# EAGLE design bluetooth_adapter (EAGLE 9.6.1)
ABTEILUNG: Technische Informatik; BEARBEITER: Markus Zundl; DATUM: 04.05.2020; DOKUMENTART: Schaltplan; GEZ: ZunM; ID: 4AHEL; REV: R1; SCHALTPLAN: Bluetooth Adapter; SCHALTPLAN2: Trinity; STATUS: Prototyp; VER: 1.0
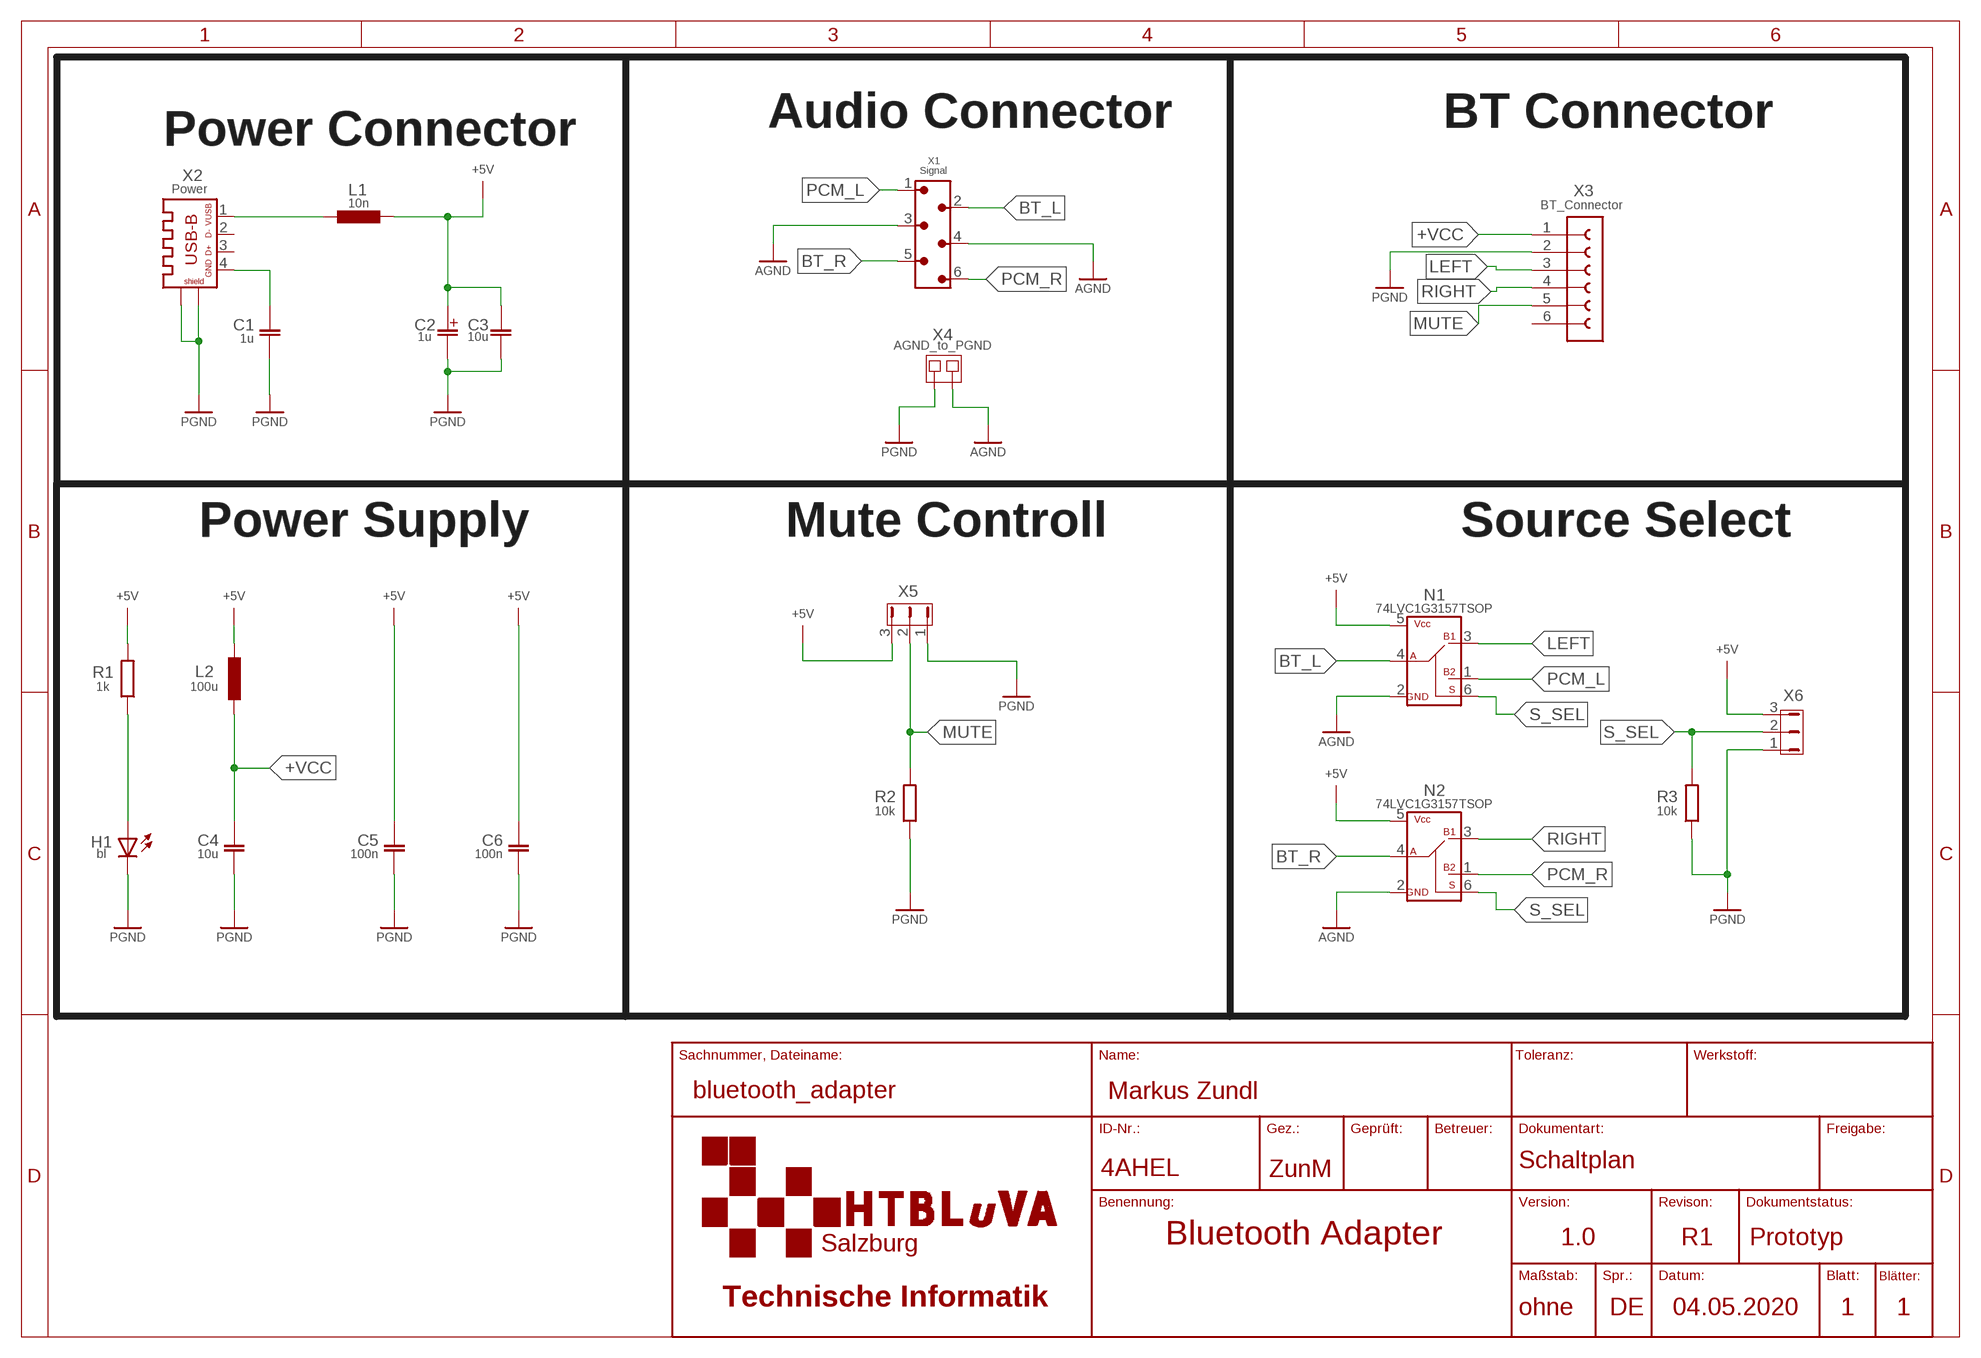
[diagram p0: schematic, sheet 1]

## Parts
C1  1u  C-EUC3216  [C3216]
C2  1u  CPOL-EUA/3216-18R  [A/3216-18R]
C3  10u  C-EUC3216  [C3216]
C4  10u  C-EUC3216  [C3216]
C5  100n  C-EUC3216  [C3216]
C6  100n  C-EUC3216  [C3216]
H1  bl  LEDCHIPLED_0805  [CHIPLED_0805]
L1  10n  L-EUL1210  [L1210]
L2  100u  L-EUL0805  [L0805]
N1  74LVC1G3157TSOP  [TSOP6]
N2  74LVC1G3157TSOP  [TSOP6]
R1  1k  R-EU_R0805  [R0805]
R2  10k  R-EU_R0805  [R0805]
R3  10k  R-EU_R0805  [R0805]
X1  Signal  WUERT_BUCHSE_6POL  [690357100672]
X2  Power  USB-B_432411  [MYLIB_USB-B-LUM]
X3  BT_Connector  CONNECTORS_FEMHD-1X61X6_BDIA  [MYCONNECTORS_FE-1X6_BDIA]
X4  AGND_to_PGND  JUMPSMD1FACH-1  [MYLIB_SJ]
X5  JP2E  [MYLIB_JP2]
X6  JP2E  [MYLIB_JP2]

## Nets
+5V: C2.+ C3.1 C5.1 C6.1 L1.2 L2.2 N1.5(VCC) N2.5(VCC) R1.2 X5.3 X6.3
+VCC: C4.1 L2.1 X3.1
AGND: N1.2(GND) N2.2(GND) X1.3 X1.4 X4.2
BT_L: N1.4(A) X1.2
BT_R: N2.4(A) X1.5
LEFT: N1.3(B1) X3.3
MUTE: R2.2 X3.5 X5.2
N$1: H1.A R1.1
N$2: C1.1 X2.4
N$3: L1.1 X2.1
PCM_L: N1.1(B2) X1.1
PCM_R: N2.1(B2) X1.6
PGND: C1.2 C2.- C3.2 C4.2 C5.2 C6.2 H1.C R2.1 R3.1 X2.SH@1(SH1) X2.SH@2(SH2) X3.2 X4.1 X5.1 X6.1
RIGHT: N2.3(B1) X3.4
S_SEL: N1.6(S) N2.6(S) R3.2 X6.2
Unconnected: X2.2 X2.3 X3.6

## Notes on the sheet
- Audio Connector | BT Connector
- Power Connector
- Power Supply | Mute Controll | Source Select

## Library data of the parts
C1 C3-C6 = rcl_HTL_V1:C-EU: CAPACITOR, European symbol
C2 = rcl_HTL_V1:CPOL-EU: POLARIZED CAPACITOR, European symbol
H1 = led_HTL_V1:LED: LED, EN-60617 OSRAM: - CHIPLED LG R971, LG N971, LY N971, LG Q971, LY Q971, LO R971, LY R971 LH N974, LH R974 LS Q976, LO Q976, LY Q976 LO Q996 - Hyper CHIPLED LW Q18S LB Q993, LB Q99A, LB R99A - SideLED LS A670, LO A670, LY A670, LG A670, LP A670 LB A673, LV A673, LT A673, LW A673 LH A674 LY A675 LS A676, LA A676, LO A676, LY A676, LW A676 LS A679, LY A679, LG A679 - Hyper Micro SIDELED® LS Y876, LA Y876, LO Y876, LY Y876 LT Y87S - SmartLED LW L88C, LW L88S LB L89C, LB L89S, LG L890 LS L89K, LO L89K, LY L89K LS L896, LA L896, LO L896, LY L896 - TOPLED LS T670, LO T670, LY T670, LG T670, LP T670 LSG T670, LSP T670, LSY T670, LOP T670, LYG T670 LG T671, LOG T671, LSG T671 LB T673, LV T673, LT T673, LW T673 LH T674 LS T676, LA T676, LO T676, LY T676, LB T676, LH T676, LSB T676, LW T676 LB T67C, LV T67C, LT T67C, LS T67K, LO T67K, LY T67K, LW E67C LS E67B, LA E67B, LO E67B, LY E67B, LB E67C, LV E67C, LT E67C LW T67C LS T679, LY T679, LG T679 LS T770, LO T770, LY T770, LG T770, LP T770 LB T773, LV T773, LT T773, LW T773 LH T774 LS E675, LA E675, LY E675, LS T675 LS T776, LA T776, LO T776, LY T776, LB T776 LHGB T686 LT T68C, LB T68C - Hyper Mini TOPLED® LB M676 - Mini TOPLED Santana® LG M470 LS M47K, LO M47K, LY M47K Source: http://www.osram.convergy.de LUXEON: - LUMILED® LXK2-PW12-R00, LXK2-PW12-S00, LXK2-PW14-U00, LXK2-PW14-V00 LXK2-PM12-R00, LXK2-PM12-S00, LXK2-PM14-U00 LXK2-PE12-Q00, LXK2-PE12-R00, LXK2-PE12-S00, LXK2-PE14-T00, LXK2-PE14-U00 LXK2-PB12-K00, LXK2-PB12-L00, LXK2-PB12-M00, LXK2-PB14-N00, LXK2-PB14-P00, LXK2-PB14-Q00 LXK2-PR12-L00, LXK2-PR12-M00, LXK2-PR14-Q00, LXK2-PR14-R00 LXK2-PD12-Q00, LXK2-PD12-R00, LXK2-PD12-S00 LXK2-PH12-R00, LXK2-PH12-S00 LXK2-PL12-P00, LXK2-PL12-Q00, LXK2-PL12-R00 Source: www.luxeon.com KINGBRIGHT: KA-3528ASYC Source: www.kingbright.com
L1 = rcl_HTL_V1:L-EU: INDUCTOR, European symbol
L2 = rcl_HTL_V1:L-EUL: INDUCTOR, European symbol
N1 N2 = ic_HTL:74LVC1G3157
R1-R3 = rcl_HTL_V1:R-EU_: RESISTOR, European symbol
X1 = con_HTL:WUERT_BUCHSE_6POL: WR-MM Male Connector w/o Latch & w. Polarization KIND PROPERTIES: Pitch 2.54 mm Quality Class :25 Mating cycles Gender:Male MATERIAL PROPERTIES: Insulator Material:PBT Insulator Flammability Rating UL94 V-0 Insulator Color:Red Contact Material :Phosphor Bronze Contact Plating :Mat Tin over Nickel Contact Type: Stamped GENERAL PROPERTIES: Operating Temperature:-40 °C up to +105 °C Compliance Lead free / RoHS ELECTRICAL PROPERTIES: IR 1:1.5 A Working Voltage 100 V (AC) Withstanding Voltage:500 V (AC) Contact Resistance: 10 mΩ Insulation Resistance:1000 MΩ PACKAGING PROPERTIES: cULus Approval:E323964 Packaging :Tube <https://katalog.we-online.com/media/images/v2/o33157v209%20Family_WR-MM_69035710xx72.jpg> Details see: https://katalog.we-online.com/en/em/MM_1_27_MALE_CONNECTOR_W_O_LATCH_AND_WITH_POLARIZATION_69035710XX72 Updated by Yingchun,Shan 2019-10-28 2019 (C) Würth Elektronik; DATASHEET-URL: https://katalog.we-online.com/em/datasheet/690357100672.pdf; GENDER: Male; IR1: 1.5A; MATES: WR-MM Female Angled Connector w. Polarization and w/o Latch/Female Angled Connector w/o Latch & w/o Polarization/Female Angled Connector with Latch & w. Polarization/Female Connector w/o Latch & w/o Polarization/Female Connector with Latch & w/o Polarization/Female SMT Connector with Latch & Polarization/Female SMT Connector with Polarization; PACKAGING: Tube; PART-NUMBER: 690357100672; PINS: 6; TCP: per Row; TYPE: Straight
X2 = con_HTL:USB-B_43
X3 = con_HTL:CONNECTORS_FEMHD-1X6: Buchsenleiste wie SPF20 nur mit 6 Pins 1-reihig
X4 = con_HTL:JUMPSMD1FACH-1: SMD solder JUMPER
X5 X6 = con_HTL:JP2E: JUMPER

## Board
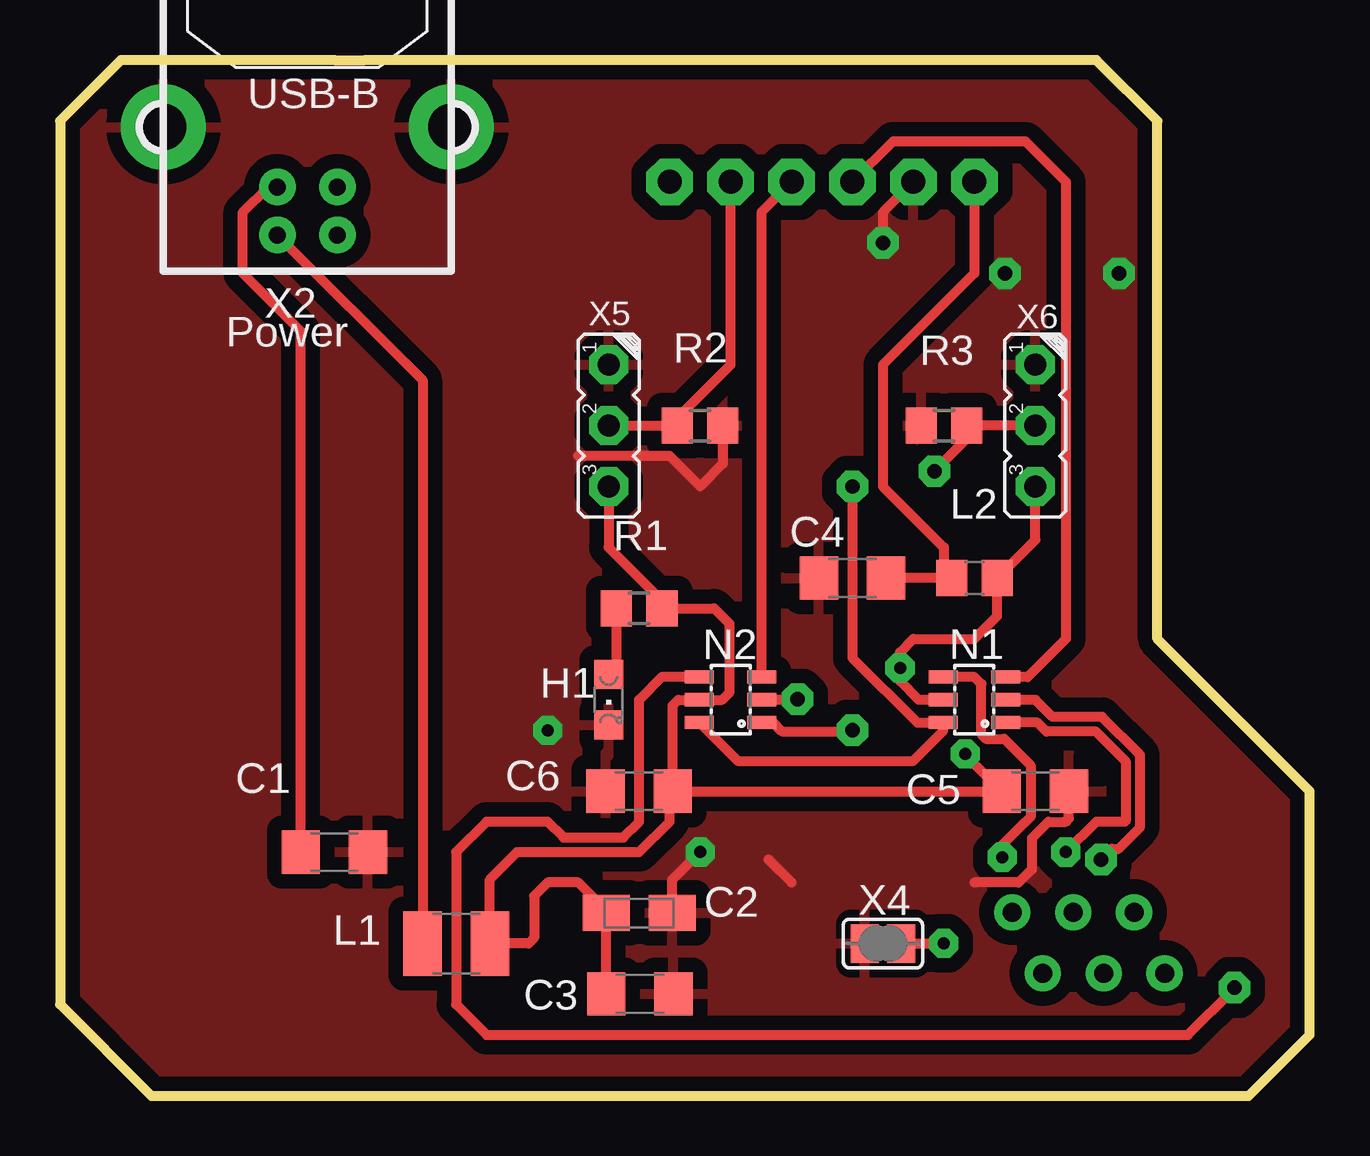
[diagram p1: board, top side]
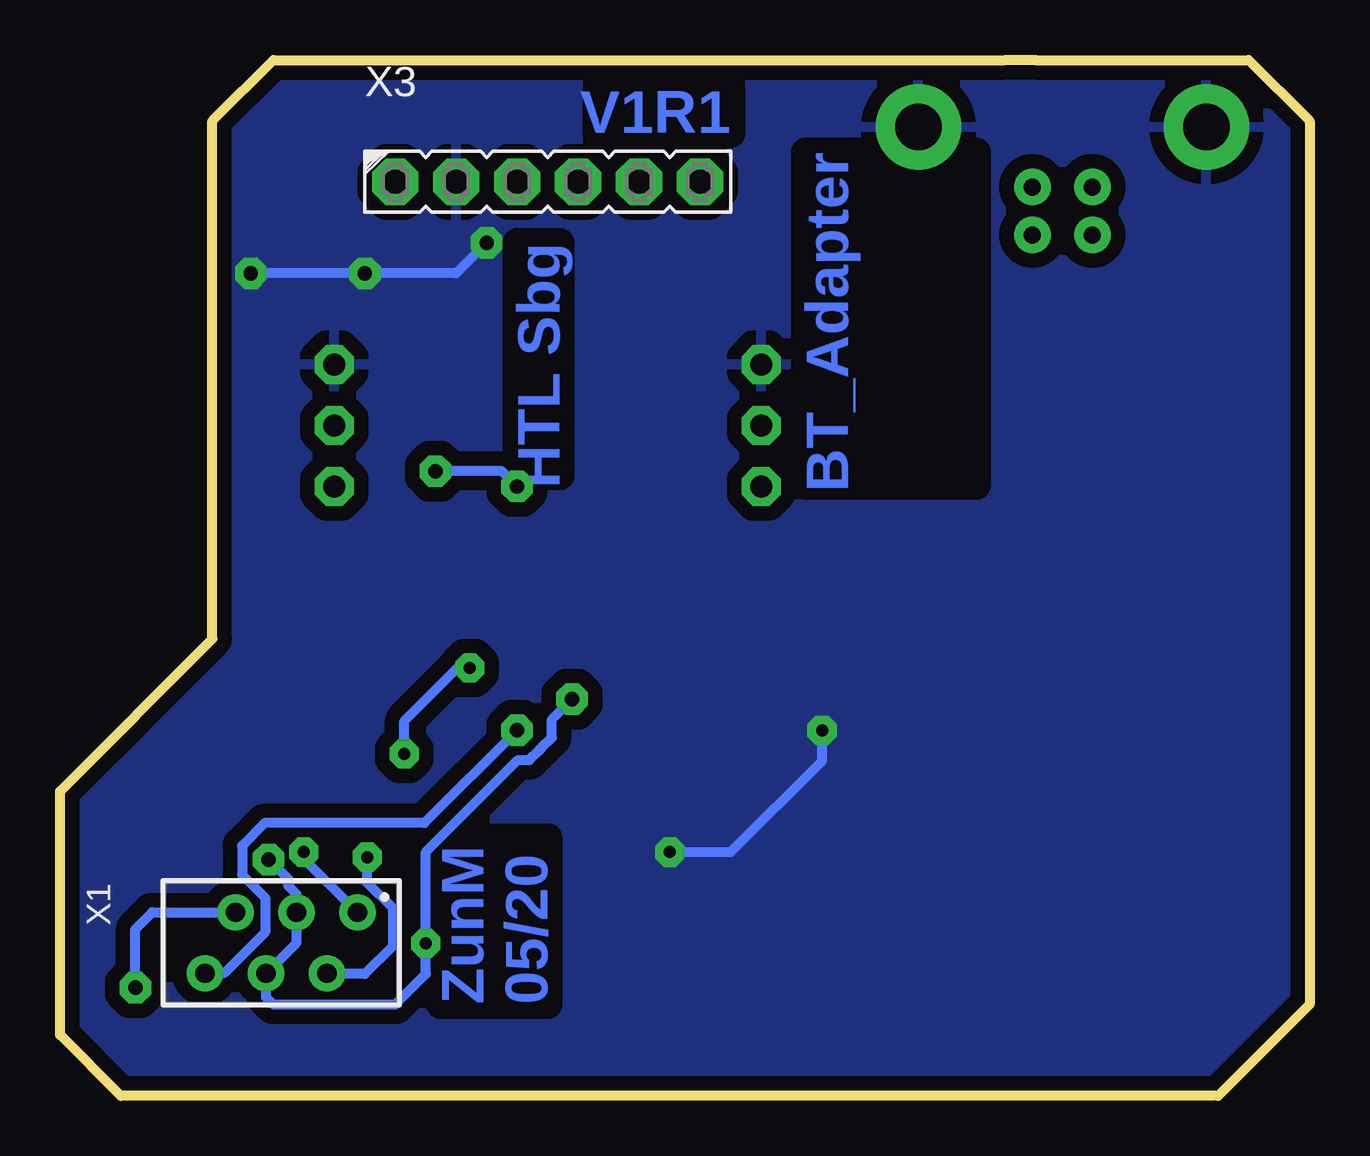
[diagram p2: board, bottom side, seen from below]

Size 52.07 x 43.18 mm. Coordinates in mm from the lower left corner, seen from the top.
Outline: 49.53,0 52.07,2.54 52.07,12.7 45.72,19.05 45.72,40.64 43.18,43.18 12.7,43.18 11.43,43.18 2.54,43.18 0,40.64 0,3.81 3.81,0 49.53,0
Copper layers (1+16): Top 0.035mm / dielectric 1.5mm / Bottom 0.035mm
Design rules "HTL": minimum track width 10mil, minimum drill 0.5mm, track to track 8mil, track to pad 8mil, pad to pad 8mil, via to via 8mil, smd to smd 8mil, copper to edge 10mil, drill to drill 8mil, minimum pad ring 14mil, minimum via ring 14mil, stop-mask expansion 4mil, vias tented up to drill 20mil, thermal gap 24mil

### Footprints (pad centres in the part's own frame; a part is rotated, then mirrored left to right if it is on the bottom)
C3216 = smd 1.6 x 1.8: 1 -1.4,0; 2 1.4,0
A/3216-18R = smd 1.95 x 1.5: + 1.375,0; - -1.375,0
CHIPLED_0805 = smd 1.2 x 1.2: A 0,-1.05; C 0,1.05
L1210 = smd 1.6 x 2.7: 1 -1.4,0; 2 1.4,0
L0805 = smd 1.3 x 1.5: 1 -0.95,0; 2 0.95,0
TSOP6 = smd 0.55 x 1.2: 1 -0.95,-1.3; 2 0,-1.3; 3 0.95,-1.3; 4 0.95,1.3; 5 0,1.3; 6 -0.95,1.3
R0805 = smd 1.3 x 1.5: 1 -0.95,0; 2 0.95,0
690357100672 = drill 0.8: 1 3.175,1.27; 2 1.905,-1.27; 3 0.635,1.27; 4 -0.635,-1.27; 5 -1.905,1.27; 6 -3.175,-1.27
MYLIB_USB-B-LUM = drill 0.711 pad 1.524: 1 -1.25,-4.5; 2 1.25,-4.5; 3 1.25,-2.5; 4 -1.25,-2.5 | drill 1.93 pad 3.556: SH@1 -6,0; SH@2 6,0
MYCONNECTORS_FE-1X6_BDIA = drill 1 pad 1.93 octagon: 1 -6.35,0; 2 -3.81,0; 3 -1.27,0; 4 1.27,0; 5 3.81,0; 6 6.35,0
MYLIB_SJ = smd 1.168 x 1.6: 1 -0.762,0; 2 0.762,0
MYLIB_JP2 = drill 0.914 octagon: 1 -2.54,0; 2 0,0; 3 2.54,0

### Placement (x,y rotation side)
C1  11.43,10.16 0 top
C2  24.13,7.62 180 top
C3  24.16,4.25 0 top
C4  33.02,21.59 180 top
C5  40.64,12.7 0 top
C6  24.13,12.7 180 top
H1  22.86,16.51 180 top
L1  16.51,6.35 0 top
L2  38.1,21.59 0 top
N1  38.1,16.51 90 top
N2  27.94,16.51 90 top
R1  24.13,20.32 0 top
R2  26.67,27.94 180 top
R3  36.83,27.94 0 top
X1  42.85,6.38 0 bottom
X2  10.3,40.38 0 top
X3  31.75,38.1 0 bottom
X4  34.29,6.35 0 top
X5  22.86,27.94 270 top
X6  40.64,27.94 270 top

### Tracks (layer width: path | path; a pad name or v marks a point on that pad's centre or on a via)
+5V  (via drill 0.5)
  Top 0.406: C6.1 25.4,12.7 25.4,11.43 24.13,10.16 19.05,10.16 17.91,9.02 L1.2 19.53,6.35 19.76,6.58 19.76,8.33 20.32,8.89 21.59,8.89 22.76,7.72 C2.+ C3.1 | C6.1 C5.1 37.91,14.03 37.79,14.03 37.72,14.1 v37.72,14.25 | X6.3 40.64,23.18 L2.2 39.05,20 38.1,19.05 35.56,19.05 35,18.49 v35,17.83 35,17.29 35.78,16.51 N1.5 | C6.1 25.53,16.27 25.77,16.51 N2.5 27.59,16.51 27.9,16.82 27.9,19.68 27.26,20.32 25.4,20.32 | R1.2 25.4,20.32 | X5.3 22.86,22.86 25.4,20.32
  Bottom 0.406: v35,17.83 35.51,17.83 37.72,15.62 v37.72,14.25
+VCC
  Top 0.406: L2.1 36.83,21.59 | 36.83,21.59 C4.1 | 36.83,21.59 36.83,22.86 34.29,25.4 34.29,30.48 38.1,34.29 X3.1
AGND  (via drill 0.5, 0.6)
  Top 0.406: v43.38,9.85 43.83,10.3 44.11,10.3 45.01,11.2 45.01,14.2 43.41,15.8 41.35,15.8 40.64,16.51 N1.2 | X4.2 v36.83,6.35 | v30.73,16.54 30.7,16.51 N2.2
  Bottom 0.406: v43.38,9.85 v43.37,9.85 42.56,9.04 42.56,8.75 42.22,8.4 X1.3 42.22,6.38 X1.4 43.48,4.12 43.18,3.81 38.1,3.81 36.83,5.08 v36.83,6.35 36.83,10.16 32.99,14 32.51,14 32.14,14.37 32.01,14.5 31.58,14.93 31.58,15.69 v30.73,16.54
BT_L  (via drill 0.5)
  Top 0.406: v39.26,9.95 39.26,10.46 40.19,11.39 40.21,11.39 40.45,11.63 40.45,13.77 39.34,14.88 38.58,14.88 38.39,15.07 38.39,17.17 38.1,17.46 N1.4
  Bottom 0.406: v39.26,9.95 v39.27,9.94 39.27,8.89 38.21,7.83 38.21,6.24 39.37,5.08 40.91,5.08 X1.2
BT_R  (via drill 0.6)
  Top 0.406: N2.4 25.08,17.46 24.13,16.51 24.13,11.43 23.47,10.77 20.98,10.77 20.32,11.43 17.78,11.43 16.51,10.16 16.51,3.81 17.78,2.54 46.99,2.54 48.92,4.47 48.93,4.47 v48.93,4.51
  Bottom 0.406: v48.93,4.51 48.93,6.95 48.23,7.65 X1.5
LEFT
  Top 0.406: N1.3 40.32,17.46 41.91,19.05 41.91,38.1 40.22,39.79 34.71,39.79 X3.3
MUTE
  Top 0.406: X5.2 R2.2 25.72,28.26 27.94,30.48 X3.5
N$1
  Top 0.406: R1.1 23.18,17.88 H1.A
N$2
  Top 0.406: 10.16,10.03 C1.1 10.03,31.88 7.62,34.29 7.62,36.83 8.68,37.88 X2.4
N$3
  Top 0.406: X2.1 15.11,29.83 L1.1
PCM_L  (via drill 0.5)
  Top 0.406: N1.1 40.73,15.56 41.1,15.19 43.16,15.19 44.4,13.95 44.4,11.45 44.38,11.43 43.18,11.43 v41.91,10.16
  Bottom 0.406: v41.91,10.16 41.91,9.88 X1.1
PCM_R  (via drill 0.6)
  Top 0.406: N2.1 29.72,15.56 30.08,15.2 32.98,15.2 v33.02,15.24
  Bottom 0.406: X1.6 45.23,5.11 43.52,6.82 43.52,8.26 44.48,9.22 44.48,10.43 43.54,11.37 36.89,11.37 v33.02,15.24
PGND  (via drill 0.5, 0.6)
  Top 0.406: 21.59,26.67 25.4,26.67 26.67,25.4 27.62,26.35 R2.1 | X3.2 34.29,36.83 v34.29,35.56 | C5.2 42.04,11.56 41.91,11.43 41.18,11.43 40.49,10.74 40.49,9.44 39.94,8.89 38.1,8.89 | 29.53,9.84 30.48,8.89 | C2.- 25.51,8.99 v26.67,10.16
  Bottom 0.406: v34.29,35.56 35.56,34.29 v39.37,34.29 v44.12,34.29 | v26.67,10.16 24.13,10.16 20.32,13.97 v20.32,15.24
  pour Bottom (isolate 0.61): 0,43.18 43.18,43.18 45.72,40.64 45.72,19.05 52.07,12.7 52.07,2.54 49.53,0 0,0
  pour Top (isolate 0.61): -2.54,43.18 43.18,43.18 45.72,40.64 45.72,19.05 52.07,12.7 52.07,2.54 49.53,0 -2.54,0
RIGHT
  Top 0.406: N2.3 29.24,36.86 X3.4
S_SEL  (via drill 0.6)
  Top 0.406: X6.2 38.1,27.94 | 38.1,27.94 R3.2 | v33.02,25.4 33.02,18.26 35.72,15.56 N1.6 36.8,15.21 35.56,13.97 28.23,13.97 N2.6 | v36.43,26.04 38.1,27.71 38.1,27.94
  Bottom 0.406: v33.02,25.4 33.66,26.04 v36.43,26.04

### Text on the board
Bottom: V1R1 | BT_Adapter | HTL Sbg | ZunM / 05/20